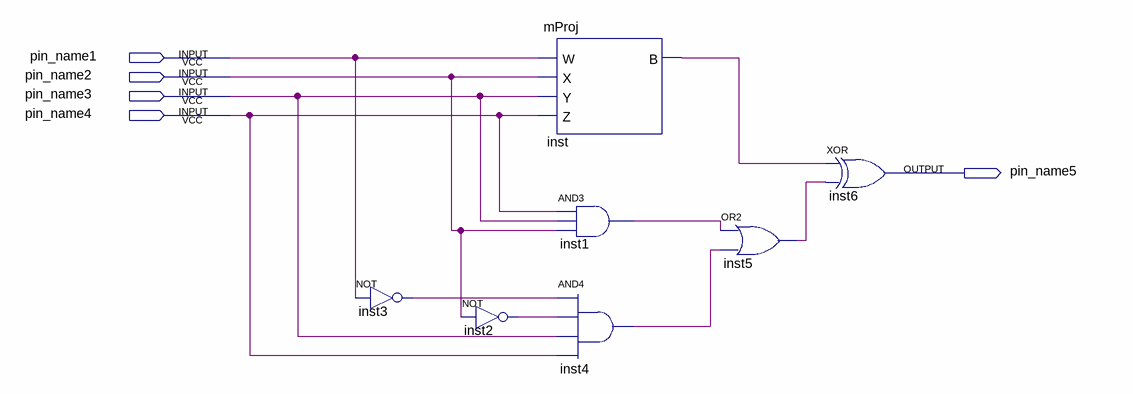
[diagram p0: schematic sheet]
// Quartus schematic Block1.bdf as structural Verilog: 7 symbols, 5 pins
module Block1 (
  input  pin_name1,
  input  pin_name2,
  input  pin_name3,
  input  pin_name4,
  output pin_name5
);

  wire inst1_out, inst2_out, inst3_out, inst4_out, inst5_out, inst_b;

  not inst3 (inst3_out, pin_name1);
  not inst2 (inst2_out, pin_name2);
  mProj inst (.W(pin_name1), .X(pin_name2), .Y(pin_name3), .Z(pin_name4), .B(inst_b));
  and inst1 (inst1_out, pin_name4, pin_name3, pin_name2);
  and inst4 (inst4_out, inst3_out, inst2_out, pin_name3, pin_name4);
  or inst5 (inst5_out, inst1_out, inst4_out);
  xor inst6 (pin_name5, inst_b, inst5_out);
endmodule
